# EAGLE design TCS32X0 (EAGLE 6.4)
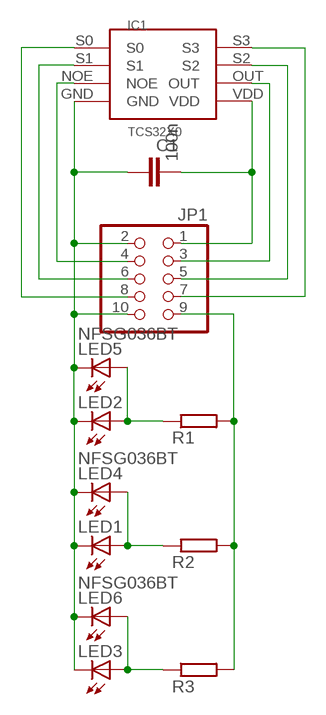
[diagram p0: schematic, sheet 1]

## Parts
C1  100n  C-EUC0805  [C0805]
IC1  TCS32X0  [TCS32X0]
JP1  PINHD-2X5  [2X05]
LED1  LED3MM  [LED3MM]
LED2  LED3MM  [LED3MM]
LED3  LED3MM  [LED3MM]
LED4  NFSG036BT  [NFSG036BT]
LED5  NFSG036BT  [NFSG036BT]
LED6  NFSG036BT  [NFSG036BT]
R1  R-EU_M0805  [M0805]
R2  R-EU_M0805  [M0805]
R3  R-EU_M0805  [M0805]

## Nets
GND: C1.1 IC1.GND JP1.2 JP1.10 LED1.K(C) LED2.K(C) LED3.K(C) LED4.C LED5.C LED6.C
N$1: JP1.9 R1.2 R2.2 R3.2
N$2: IC1.NOE JP1.4
N$3: IC1.S1 JP1.6
N$5: C1.2 IC1.VDD JP1.1
N$6: IC1.OUT JP1.3
N$7: IC1.S2 JP1.5
N$9: LED2.A LED5.A R1.1
N$10: LED1.A LED4.A R2.1
N$11: LED3.A LED6.A R3.1
N$12: IC1.S0 JP1.8
N$13: IC1.S3 JP1.7

## Library data of the parts
C1 = rcl:C-EU: CAPACITOR, European symbol
IC1 = BEEP:TCS32X0
JP1 = pinhead:PINHD-2X5: PIN HEADER
LED1-LED3 = led:LED: LED OSRAM: - CHIPLED LG R971, LG N971, LY N971, LG Q971, LY Q971, LO R971, LY R971 LH N974, LH R974 LS Q976, LO Q976, LY Q976 LO Q996 - Hyper CHIPLED LW Q18S LB Q993, LB Q99A, LB R99A - SideLED LS A670, LO A670, LY A670, LG A670, LP A670 LB A673, LV A673, LT A673, LW A673 LH A674 LY A675 LS A676, LA A676, LO A676, LY A676, LW A676 LS A679, LY A679, LG A679 - Hyper Micro SIDELED® LS Y876, LA Y876, LO Y876, LY Y876 LT Y87S - SmartLED LW L88C, LW L88S LB L89C, LB L89S, LG L890 LS L89K, LO L89K, LY L89K LS L896, LA L896, LO L896, LY L896 - TOPLED LS T670, LO T670, LY T670, LG T670, LP T670 LSG T670, LSP T670, LSY T670, LOP T670, LYG T670 LG T671, LOG T671, LSG T671 LB T673, LV T673, LT T673, LW T673 LH T674 LS T676, LA T676, LO T676, LY T676, LB T676, LH T676, LSB T676, LW T676 LB T67C, LV T67C, LT T67C, LS T67K, LO T67K, LY T67K, LW E67C LS E67B, LA E67B, LO E67B, LY E67B, LB E67C, LV E67C, LT E67C LW T67C LS T679, LY T679, LG T679 LS T770, LO T770, LY T770, LG T770, LP T770 LB T773, LV T773, LT T773, LW T773 LH T774 LS E675, LA E675, LY E675, LS T675 LS T776, LA T776, LO T776, LY T776, LB T776 LHGB T686 LT T68C, LB T68C - Hyper Mini TOPLED® LB M676 - Mini TOPLED Santana® LG M470 LS M47K, LO M47K, LY M47K Source: http://www.osram.convergy.de LUXEON: - LUMILED® LXK2-PW12-R00, LXK2-PW12-S00, LXK2-PW14-U00, LXK2-PW14-V00 LXK2-PM12-R00, LXK2-PM12-S00, LXK2-PM14-U00 LXK2-PE12-Q00, LXK2-PE12-R00, LXK2-PE12-S00, LXK2-PE14-T00, LXK2-PE14-U00 LXK2-PB12-K00, LXK2-PB12-L00, LXK2-PB12-M00, LXK2-PB14-N00, LXK2-PB14-P00, LXK2-PB14-Q00 LXK2-PR12-L00, LXK2-PR12-M00, LXK2-PR14-Q00, LXK2-PR14-R00 LXK2-PD12-Q00, LXK2-PD12-R00, LXK2-PD12-S00 LXK2-PH12-R00, LXK2-PH12-S00 LXK2-PL12-P00, LXK2-PL12-Q00, LXK2-PL12-R00 Source: www.luxeon.com KINGBRIGHT: KA-3528ASYC Source: www.kingbright.com
LED4-LED6 = led:NFSG036BT: CHIP TYPE GREEN LED NFSx036xT Source: NICHIA CORPORATION .. NFSG036BT-E.pdf
R1-R3 = rcl:R-EU_: RESISTOR, European symbol

## Board
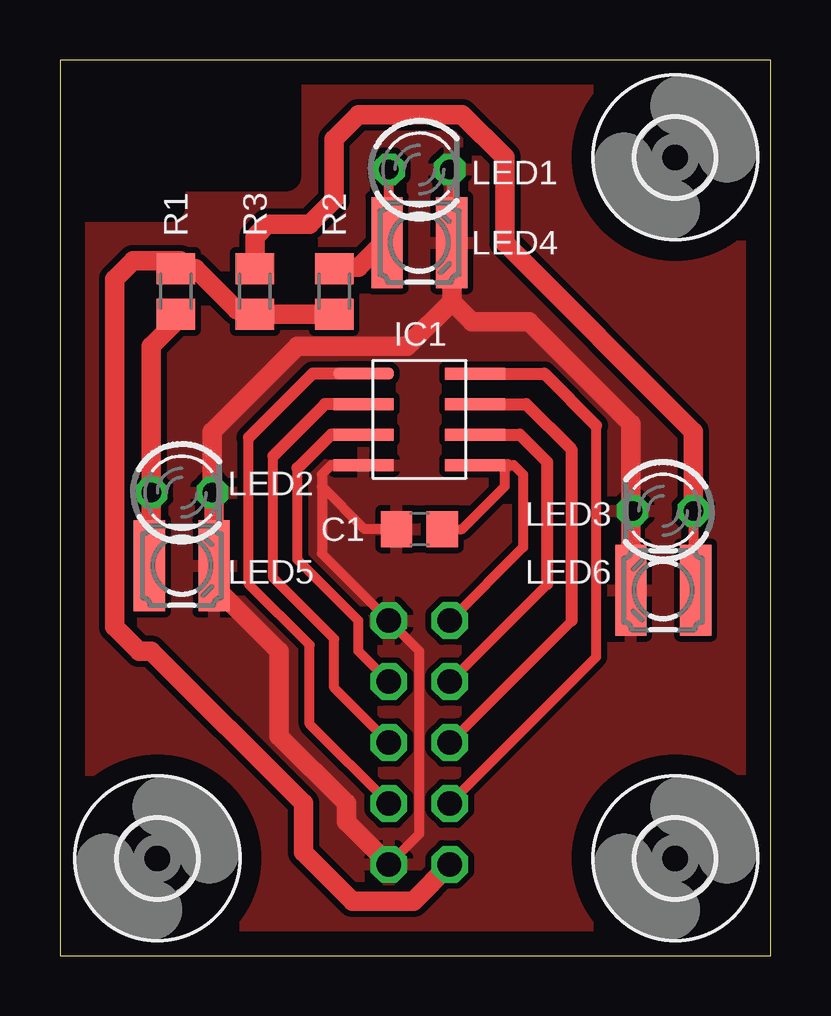
[diagram p1: board, top side]
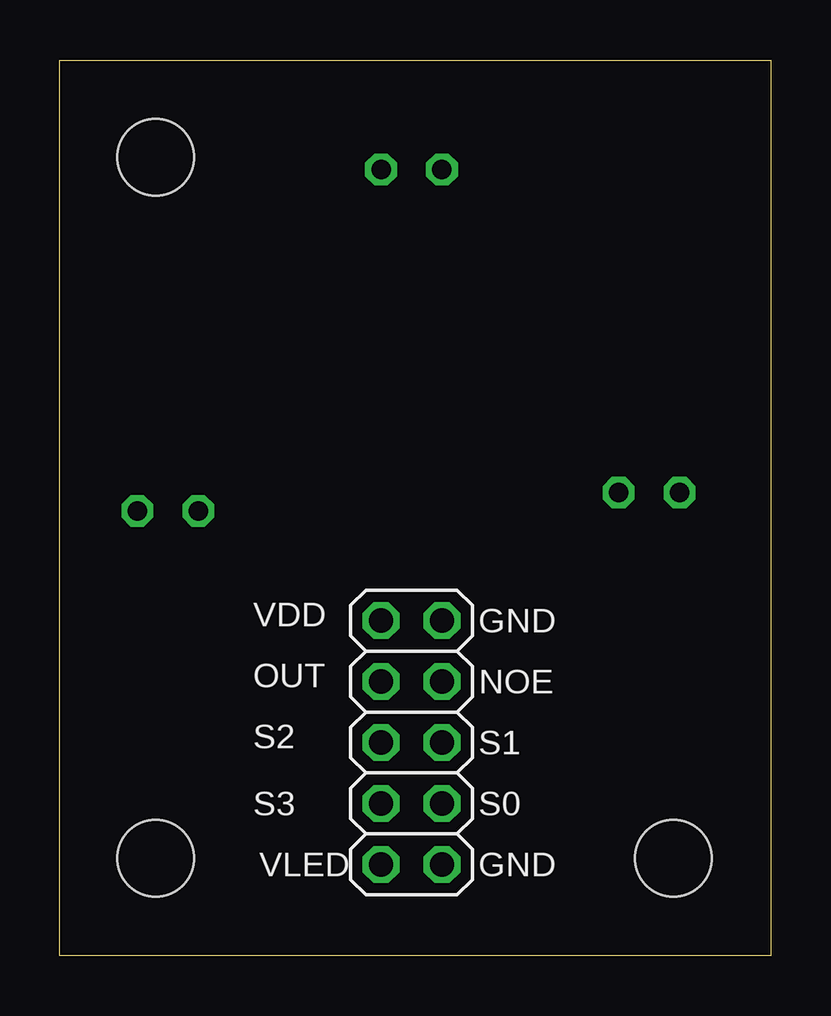
[diagram p2: board, bottom side, seen from below]

Size 29.64 x 37.33 mm. Coordinates in mm from the lower left corner, seen from the top.
Outline: 0,0 29.64,0 29.64,37.33 0,37.33 0,0
Copper layers (1*16): Top 0.035mm / dielectric 1.5mm / Bottom 0.035mm
Design rules "default *": minimum track width 10mil, minimum drill 24mil, track to track 10mil, track to pad 10mil, pad to pad 8mil, via to via 8mil, smd to smd 8mil, copper to edge 40mil, drill to drill 8mil, minimum pad ring 10mil, minimum via ring 8mil, stop-mask expansion 4mil, vias tented up to drill 0mil, thermal gap 10mil
tRestrict: area 0,31.2 to 9.4,37.3

### Footprints (pad centres in the part's own frame; a part is rotated, then mirrored left to right if it is on the bottom)
C0805 = smd 1.3 x 1.5: 1 -0.95,0; 2 0.95,0
TCS32X0 = smd 0.5 x 2.5: GND 1.905,-2.325; NOE 0.635,-2.325; OUT 0.635,2.325; S0 -1.905,-2.325; S1 -0.635,-2.325; S2 -0.635,2.325; S3 -1.905,2.325; VDD 1.905,2.325
2X05 = drill 1.016 octagon: 1 -5.08,-1.27; 2 -5.08,1.27; 3 -2.54,-1.27; 4 -2.54,1.27; 5 0,-1.27; 6 0,1.27; 7 2.54,-1.27; 8 2.54,1.27; 9 5.08,-1.27; 10 5.08,1.27
LED3MM = drill 0.813 octagon: A -1.27,0; K 1.27,0
NFSG036BT = smd 1.3 x 3.8: A 1.35,0; C -1.35,0
M0805 = smd 1.3 x 1.6: 1 -0.95,0; 2 0.95,0
3,2 = hole 3.2: 0,0

### Placement (x,y rotation side)
C1  14.99,17.78 0 top
IC1  14.99,22.35 270 top
JP1  14.99,8.89 270 bottom
LED1  14.99,32.77 0 top
LED2  5.08,19.3 0 top
LED3  25.15,18.54 180 top
LED4  14.99,29.72 180 top
LED5  5.08,16.26 180 top
LED6  25.15,15.24 0 top
R1  4.83,27.69 90 top
R2  11.43,27.69 270 top
R3  8.13,27.69 270 top
U$1  LOGO-COPPER4  [COPPER4]  1.02,34.54 0 top
U$2  [3,2]  4.06,4.06 0 top
U$3  [3,2]  25.65,4.06 0 top
U$4  [3,2]  25.65,33.27 0 top

### Tracks (layer width: path | path; a pad name or v marks a point on that pad's centre or on a via)
GND
  Top 0.406: 13.21,17.78 C1.1 12.7,17.78 10.92,19.56 | IC1.GND 11.3,20.45 10.92,20.07 10.92,19.56 | 10.92,19.56 10.92,16.76 JP1.2 14.99,12.7 14.99,5.08 JP1.10 | 6.43,19.22 LED2.K | LED6.C 23.8,18.46 LED3.K | 6.35,15.49 6.35,16.18 LED5.C | LED4.C 16.34,32.69 LED1.K
  Top 0.813: LED5.C 6.43,19.22 | LED4.C 16.34,27.26 | 16.34,27.26 14.48,25.4 9.91,25.4 6.35,21.84 LED2.K | LED6.C 23.8,22.18 19.56,26.42 17.18,26.42 16.34,27.26 | JP1.10 11.94,5.59 11.94,6.35 9.14,9.14 9.14,12.7 6.35,15.49
  pour Top (isolate 0.254): 0,37.34 29.72,37.34 29.72,0 0,0
N$1
  Top 0.406: 5.01,28.96 R1.2
  Top 0.813: R2.2 R3.2 7.94,26.92 7.37,26.92 5.65,28.64 R1.2 | JP1.9 14.73,2.29 12.19,2.29 10.16,4.32 10.16,6.35 3.81,12.7 3.3,12.7 2.29,13.72 2.29,28.19 3.05,28.96 5.01,28.96
N$2
  Top 0.406: JP1.4 12.45,12.7 12.45,13.97 9.91,16.51 9.91,20.32
  Top 0.508: IC1.NOE 11.3,21.72 9.91,20.32
N$3
  Top 0.406: JP1.6 11.43,11.18 11.43,13.21 8.89,15.75 8.89,20.83
  Top 0.508: 8.89,20.83 11.05,22.99 IC1.S1
N$5
  Top 0.406: C1.2 16.76,17.78 18.54,19.56 18.54,20.32 | 18.67,20.45 18.92,20.45 19.3,20.07 19.3,17.02 JP1.1
  Top 0.508: IC1.VDD 18.67,20.45 18.54,20.32
N$6
  Top 0.406: 20.32,15.49 JP1.3
  Top 0.508: 20.32,15.49 20.32,20.57 19.18,21.72 IC1.OUT
N$7
  Top 0.406: JP1.5 21.34,13.97
  Top 0.508: 21.34,13.97 21.34,21.08 19.43,22.99 IC1.S2
N$9
  Top 0.508: R1.1 5.01,26.6
  Top 0.813: 5.01,26.6 3.81,25.4 LED2.A 3.81,16.34 LED5.A
N$10
  Top 0.406: LED1.A 13.72,29.97 13.72,29.8 LED4.A
  Top 0.508: 11.5,28.7 R2.1
  Top 0.813: 13.72,29.97 12.45,28.7 11.5,28.7
N$11
  Top 0.406: LED3.A 26.42,15.32 LED6.A
  Top 0.813: LED3.A 26.42,21.84 18.54,29.72 18.54,33.27 16.76,35.05 12.45,35.05 11.43,34.04 11.43,31.5 10.41,30.48 8.64,30.48 8.13,29.97 R3.1
N$12
  Top 0.406: JP1.8 10.41,9.65 10.41,12.95 7.87,15.49 7.87,21.59
  Top 0.508: IC1.S0 10.54,24.26 7.87,21.59
N$13
  Top 0.406: 22.35,22.1 22.35,12.45 JP1.7
  Top 0.508: 22.35,22.1 20.19,24.26 IC1.S3 17.14,24.26

### Text on the board
bNames: GND | VDD | OUT | NOE | S1 | S2 | S0 | S3 | GND | VLED
tCName: TCS32X0 / v0.1.1